# EAGLE design LEDMotherboardv2 (EAGLE 6.5.0)
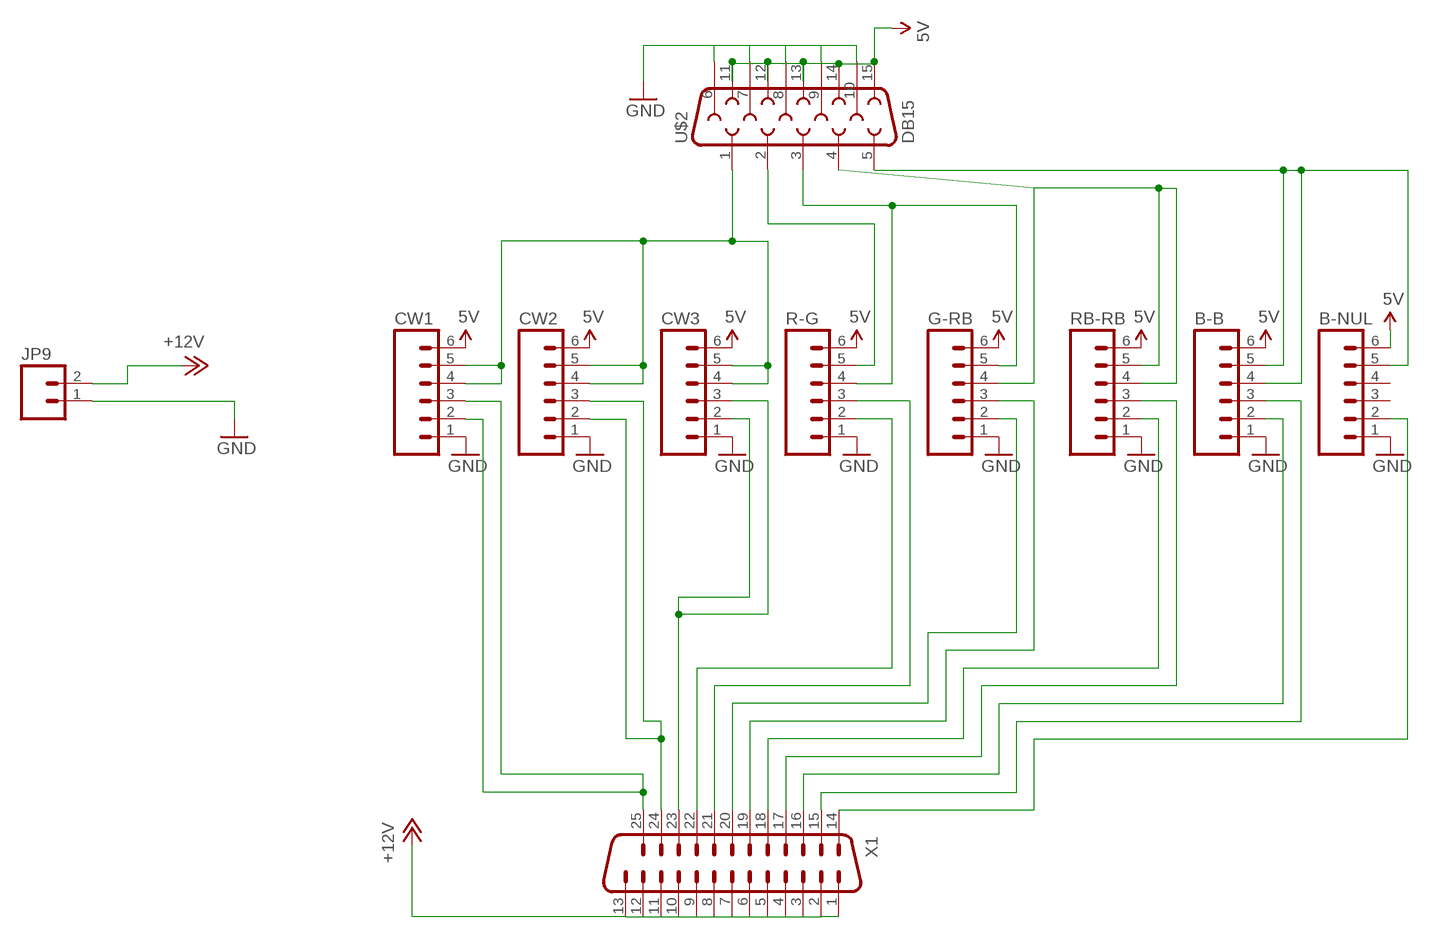
[diagram p0: schematic, sheet 1]

## Parts
B-B  M06LOCK_LONGPADS  [1X06_LOCK_LONGPADS]
B-NUL  M06LOCK_LONGPADS  [1X06_LOCK_LONGPADS]
CW1  M06LOCK_LONGPADS  [1X06_LOCK_LONGPADS]
CW2  M06LOCK_LONGPADS  [1X06_LOCK_LONGPADS]
CW3  M06LOCK_LONGPADS  [1X06_LOCK_LONGPADS]
G-RB  M06LOCK_LONGPADS  [1X06_LOCK_LONGPADS]
JP9  M02  [02P]
R-G  M06LOCK_LONGPADS  [1X06_LOCK_LONGPADS]
RB-RB  M06LOCK_LONGPADS  [1X06_LOCK_LONGPADS]
U$2  DB15  [DB15]
X1  DB25HP  [M25HP]

## Nets
5V: B-B.6 B-NUL.6 CW1.6 CW2.6 CW3.6 G-RB.6 R-G.6 RB-RB.6 U$2.11 U$2.12 U$2.13 U$2.14 U$2.15
+12V: JP9.2 X1.1 X1.2 X1.3 X1.4 X1.5 X1.6 X1.7 X1.8 X1.9 X1.10 X1.11 X1.12 X1.13
GND: B-B.1 B-NUL.1 CW1.1 CW2.1 CW3.1 G-RB.1 JP9.1 R-G.1 RB-RB.1 U$2.6 U$2.7 U$2.8 U$2.9 U$2.10
N$1: R-G.5 U$2.2
N$2: B-B.4 B-B.5 B-NUL.5 U$2.5
N$3: CW1.4 CW1.5 CW2.4 CW2.5 CW3.4 CW3.5 U$2.1
N$7: CW2.2 CW2.3 X1.24
N$13: G-RB.5 R-G.4 U$2.3
N$15: G-RB.4 RB-RB.4 RB-RB.5 U$2.4
N$21: CW3.2 CW3.3 X1.23
N$22: R-G.3 X1.21
N$23: R-G.2 X1.22
N$24: G-RB.2 X1.20
N$25: CW1.2 CW1.3 X1.25
N$27: G-RB.3 X1.19
N$28: RB-RB.2 X1.18
N$29: RB-RB.3 X1.17
N$30: B-B.2 X1.16
N$31: B-B.3 X1.15
N$32: B-NUL.2 X1.14
Unconnected: B-NUL.3 B-NUL.4

## Library data of the parts
B-B B-NUL CW1-CW3 G-RB R-G RB-RB = SparkFun-Connectors:M06: Header 6 Standard 6-pin 0.1" header. Use with straight break away headers (SKU : PRT-00116), right angle break away headers (PRT-00553), swiss pins (PRT-00743), machine pins (PRT-00117), and female headers (PRT-00115). Molex polarized connector foot print use with SKU : PRT-08094 with associated crimp pins and housings. NOTES ON THE VARIANTS LOCK and LOCK_LONGPADS... This footprint was designed to help hold the alignment of a through-hole component (i.e. 6-pin header) while soldering it into place. You may notice that each hole has been shifted either up or down by 0.005 of an inch from it's more standard position (which is a perfectly straight line). This slight alteration caused the pins (the squares in the middle) to touch the edges of the holes. Because they are alternating, it causes a "brace" to hold the component in place. 0.005 has proven to be the perfect amount of "off-center" position when using our standard breakaway headers. Although looks a little odd when you look at the bare footprint, once you have a header in there, the alteration is very hard to notice. Also,if you push a header all the way into place, it is covered up entirely on the bottom side. This idea of altering the position of holes to aid alignment will be further integrated into the Sparkfun Library for other footprints. It can help hold any component with 3 or more connection pins.
JP9 = con-amp-quick:M02: AMP QUICK CONNECTOR; OC_FARNELL: unknown; OC_NEWARK: unknown
U$2 = SparkFun-Connectors:DB15: DB15 / VGA right angle through-hole female connector.
X1 = SparkFun-Connectors:DB25: Various DB25 connectors

## Board
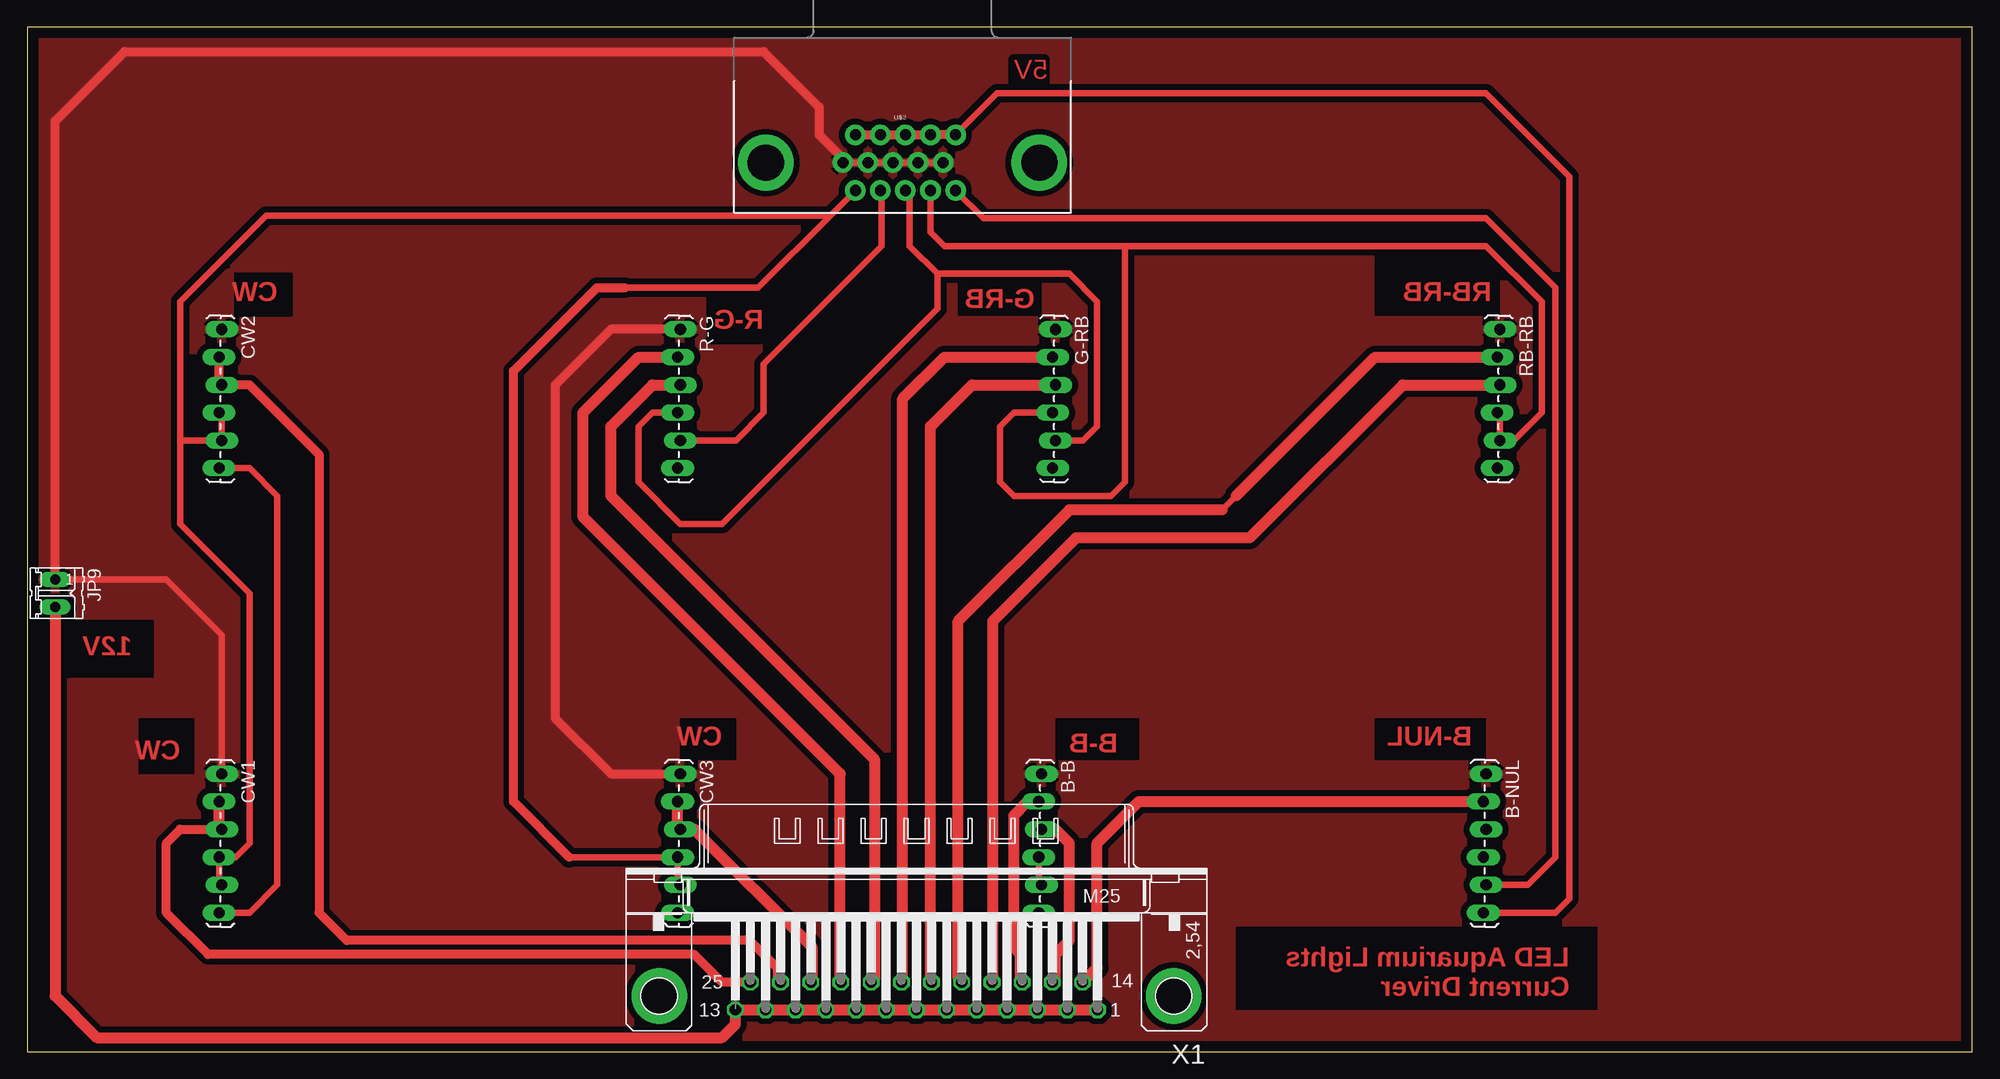
[diagram p1: board, top side]
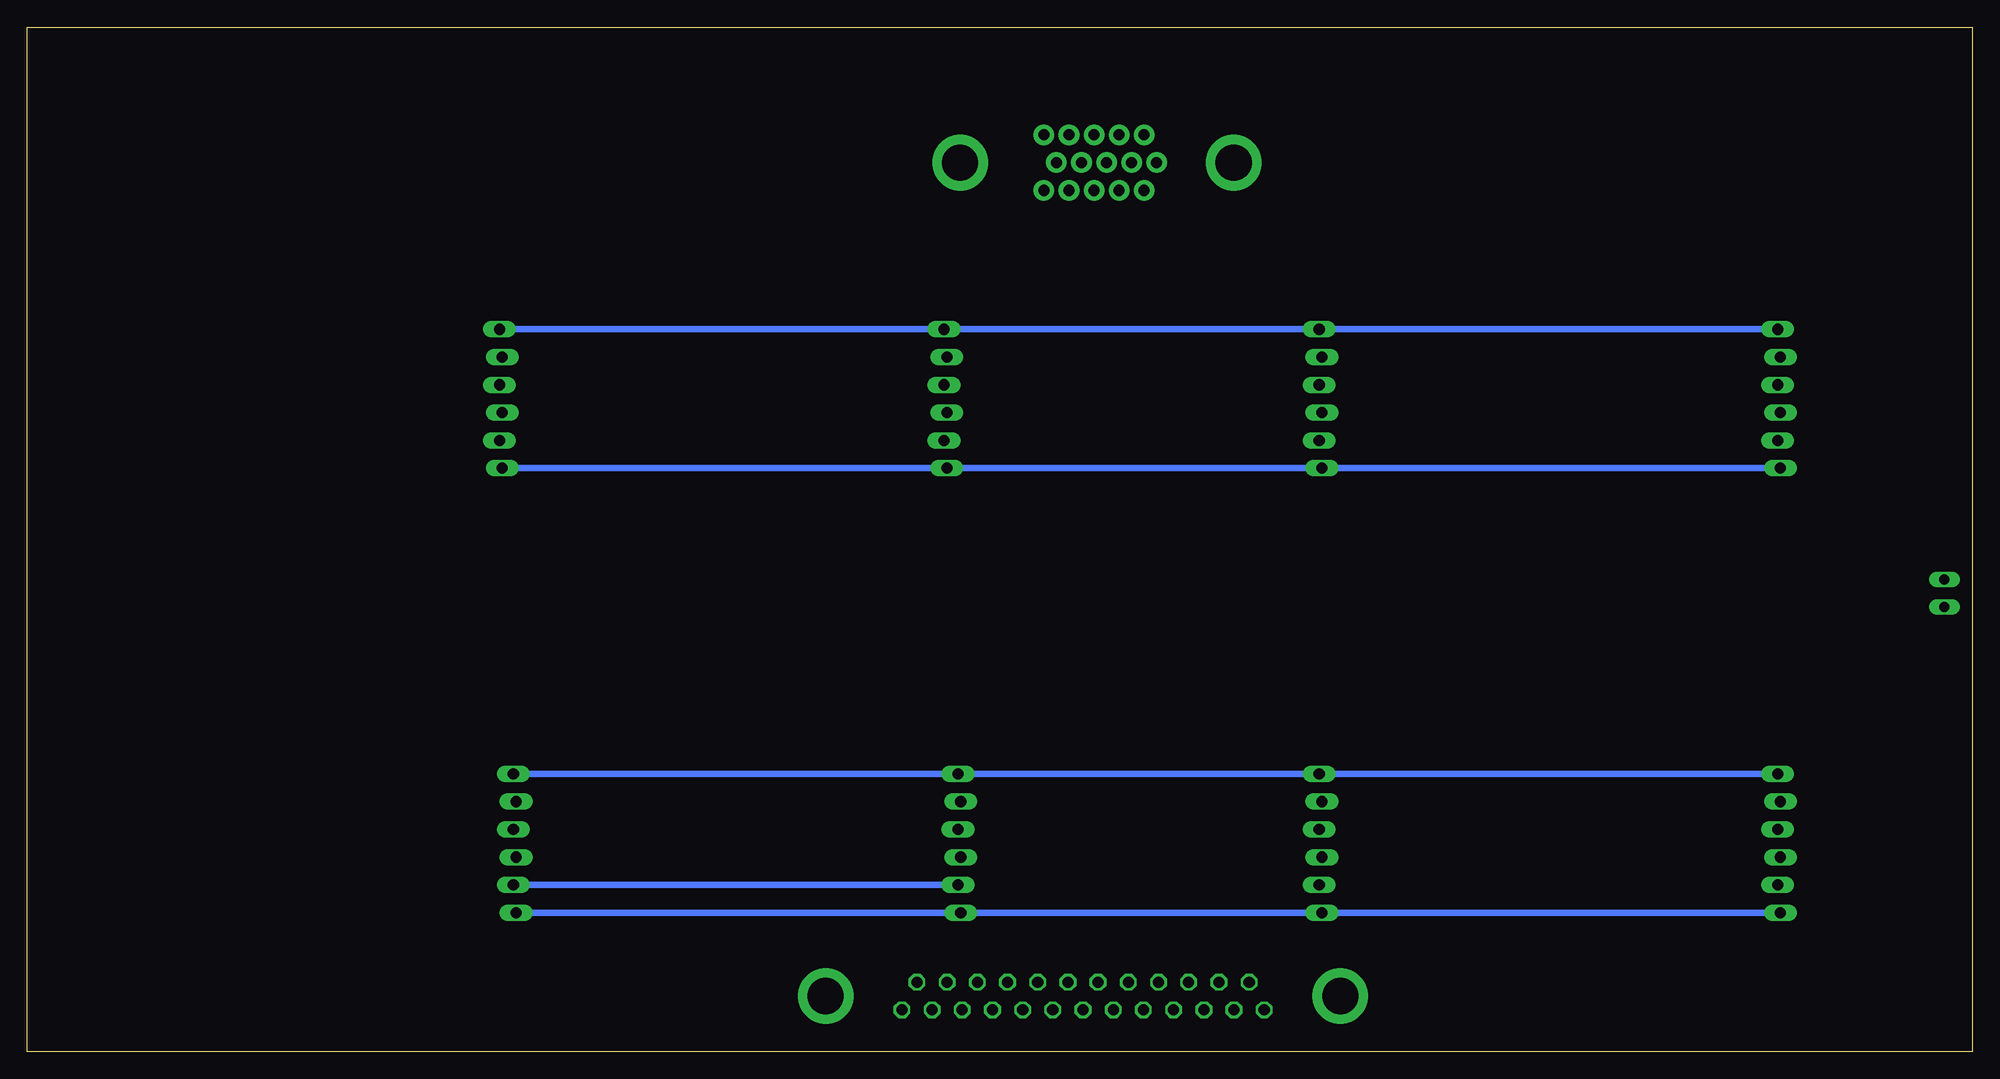
[diagram p2: board, bottom side, seen from below]

Size 177.78 x 93.65 mm. Coordinates in mm from the lower left corner, seen from the top.
Outline: 0,0 177.78,0 177.78,93.65 0,93.65 0,0
Copper layers (1*16): Top 0.035mm / dielectric 1.5mm / Bottom 0.035mm
Design rules "default": minimum track width 10mil, minimum drill 24mil, track to track 8mil, track to pad 8mil, pad to pad 8mil, via to via 8mil, smd to smd 8mil, copper to edge 40mil, drill to drill 8mil, minimum pad ring 10mil, minimum via ring 8mil, stop-mask expansion 4mil, vias tented up to drill 0mil, thermal gap 10mil

### Footprints (pad centres in the part's own frame; a part is rotated, then mirrored left to right if it is on the bottom)
1X06_LOCK_LONGPADS = drill 1.016 long: 1 0,0; 2 2.54,-0.254; 3 5.08,0; 4 7.62,-0.254; 5 10.16,0; 6 12.7,-0.254
02P = drill 0.914 long: 1 -1.27,0; 2 1.27,0
DB15 = drill 1.016 pad 1.88: 1 -4.32,-7.62; 2 -2.03,-7.62; 3 0.26,-7.62; 4 2.55,-7.62; 5 4.84,-7.62; 6 -5.46,-5.08; 7 -3.17,-5.08; 8 -0.88,-5.08; 9 1.41,-5.08; 10 3.7,-5.08; 11 -4.32,-2.54; 12 -2.03,-2.54; 13 0.26,-2.54; 14 2.55,-2.54; 15 4.84,-2.54 | drill 3.302 pad 5.08: G1 -12.5,-5.08; G2 12.5,-5.08
M25HP = drill 1.016 octagon: 1 -16.561,1.27; 2 -13.792,1.27; 3 -11.049,1.27; 4 -8.28,1.27; 5 -5.512,1.27; 6 -2.769,1.27; 7 0,1.27; 8 2.769,1.27; 9 5.512,1.27; 10 8.28,1.27; 11 11.049,1.27; 12 13.792,1.27; 13 16.561,1.27; 14 -15.189,-1.27; 15 -12.421,-1.27; 16 -9.652,-1.27; 17 -6.909,-1.27; 18 -4.14,-1.27; 19 -1.372,-1.27; 20 1.372,-1.27; 21 4.14,-1.27; 22 6.909,-1.27; 23 9.652,-1.27; 24 12.421,-1.27; 25 15.189,-1.27 | drill 3.302 pad 5.08: G1 -23.52,0; G2 23.52,0

### Placement (x,y rotation side)
B-B  92.71,25.4 270 top
B-NUL  133.35,25.4 270 top
CW1  17.78,25.4 270 top
CW2  17.78,66.04 270 top
CW3  59.69,25.4 270 top
G-RB  93.98,66.04 270 top
JP9  2.54,41.91 270 top
R-G  59.69,66.04 270 top
RB-RB  134.62,66.04 270 top
U$2  80.01,86.36 0 top
X1  81.28,5.08 180 top

### Tracks (layer width: path | path; a pad name or v marks a point on that pad's centre or on a via)
5V
  Top 0.61: U$2.15 88.66,87.63 133.35,87.63 140.97,80.01 140.97,13.97 139.7,12.7 B-NUL.6 | CW1.6 20.32,12.7 22.86,15.24 22.86,50.8 20.32,53.34 CW2.6
  Top 0.813: U$2.15 U$2.14 U$2.13 U$2.12 U$2.11
  Bottom 0.61: CW2.6 R-G.6 G-RB.6 RB-RB.6 | CW1.6 CW3.6 B-B.6 B-NUL.6
+12V
  Top 1.016: JP9.2 2.54,5.08 6.35,1.27 63.5,1.27 64.72,2.49 X1.13 X1.12 X1.11 X1.10 X1.9 X1.8 X1.7 X1.6 X1.5 X1.4 X1.3 X1.2 X1.1
GND
  Top 0.61: U$2.6 U$2.7 U$2.8 U$2.9 U$2.10 | JP9.1 12.7,43.18 17.78,38.1 CW1.1
  Top 0.813: JP9.1 2.54,85.09 8.89,91.44 67.31,91.44 72.39,86.36 72.39,83.82 74.55,81.66 U$2.6 | CW3.1 53.34,25.4 48.26,30.48 48.26,60.96 53.34,66.04 R-G.1
  Bottom 0.61: B-NUL.1 B-B.1 CW3.1 CW1.1 | RB-RB.1 G-RB.1 R-G.1 CW2.1
  pour Top (isolate 0.533): -1.27,95.25 179.07,95.25 179.07,-1.27 -1.27,-1.27
N$1
  Top 0.61: U$2.2 78.11,78.61 78.11,73.66 67.31,62.87 67.31,58.42 64.77,55.88 R-G.5
N$2
  Top 0.61: B-B.5 92.46,15.49 B-B.4 | U$2.5 87.39,76.2 133.35,76.2 139.7,69.85 139.7,17.78 137.16,15.24 B-NUL.5
  Bottom 0.61: B-B.5 B-NUL.5
N$3
  Top 0.61: CW2.4 17.78,58.17 CW2.5 13.97,55.88 | U$2.1 73.41,76.45 | 73.41,76.45 66.8,69.85 54.61,69.85 | 49.53,17.78 CW3.4 59.44,15.49 CW3.5 | CW1.5 17.53,15.49 CW1.4 19.05,17.78 20.32,19.05 20.32,41.91 13.97,48.26 13.97,55.88 | 13.97,55.88 13.97,68.58 21.84,76.45 73.41,76.45
  Top 0.813: 49.53,17.78 44.45,22.86 44.45,62.23 52.07,69.85 54.61,69.85
N$4
  cutout Top (rank 6): 3.81,39.37 11.43,39.37 11.43,34.29 3.81,34.29
N$5
  cutout Top: 19.05,68.58 19.05,71.12 24.13,71.12 24.13,67.31 19.05,67.31
N$6
  cutout Top: 62.23,68.58 68.58,68.58 68.58,64.77 62.23,64.77
N$7
  Top 0.813: X1.24 68.58,6.63 68.58,7.62 66.04,10.16 29.21,10.16 26.67,12.7 26.67,54.61 20.32,60.96 CW2.3 17.53,61.21 CW2.2
N$8
  cutout Top (isolate 0.254): 85.09,69.85 92.71,69.85 92.71,67.31 85.09,67.31
N$9
  cutout Top (isolate 0.254): 123.19,72.39 134.62,72.39 134.62,67.31 123.19,67.31 123.19,71.12
N$10
  cutout Top (isolate 0.254): 133.35,26.67 123.19,26.67 123.19,30.48 133.35,30.48
N$11
  cutout Top (isolate 0.254): 93.98,30.48 101.6,30.48 101.6,26.67 93.98,26.67 93.98,29.21
N$12
  cutout Top (isolate 0.254): 59.69,30.48 64.77,30.48 64.77,26.67 59.69,26.67
N$13
  Top 0.61: U$2.3 80.64,78.36 80.64,73.66 83.19,71.12 | 83.19,71.12 95.25,71.12 97.79,68.58 97.79,57.15 96.52,55.88 G-RB.5 | R-G.4 57.15,58.42 55.88,57.15 55.88,52.07 59.69,48.26 63.5,48.26 83.19,67.94 83.19,71.12
N$14
  cutout Top (isolate 0.254): 10.16,30.48 15.24,30.48 15.24,25.4 10.16,25.4
N$15
  Top 0.61: U$2.4 82.55,74.93 83.82,73.66 100.33,73.66 | 100.33,73.66 133.35,73.66 138.43,68.58 138.43,58.42 135.89,55.88 RB-RB.5 134.62,58.17 RB-RB.4 | G-RB.4 90.17,58.42 88.9,57.15 88.9,52.07 90.17,50.8 99.06,50.8 100.33,52.07 100.33,73.66
N$16
  cutout Top (isolate 0.254): 110.49,11.43 143.51,11.43 143.51,3.81 110.49,3.81
N$21
  Top 0.61: CW3.3 59.44,20.57
  Top 0.813: X1.23 71.75,6.48 | 60.96,20.32 CW3.3
  Top 1.016: 71.75,6.48 71.75,9.53 60.96,20.32 | 59.44,20.57 CW3.2
N$22
  Top 0.813: X1.21 77.47,6.68
  Top 1.016: 77.47,6.68 77.47,26.67 53.34,50.8 53.34,57.15 57.15,60.96 R-G.3
N$23
  Top 0.813: X1.22 74.3,6.43
  Top 1.016: 74.3,6.43 74.3,25.4 50.8,48.9 50.8,58.42 55.88,63.5 R-G.2
N$24
  Top 0.813: X1.20 80.01,6.45
  Top 1.016: 80.01,6.45 80.01,59.69 83.82,63.5 G-RB.2
N$25
  Top 0.61: CW1.3 17.53,20.57
  Top 0.813: X1.25 63.5,6.35 60.96,8.89 16.51,8.89 12.7,12.7 12.7,19.05 13.97,20.32 CW1.3
  Top 1.016: 17.53,20.57 CW1.2
N$27
  Top 0.813: X1.19 82.55,6.45
  Top 1.016: 82.55,6.45 82.55,57.15 86.36,60.96 G-RB.3
N$28
  Top 0.61: 110.49,50.8 109.22,49.53
  Top 0.813: X1.18 85.09,6.68
  Top 1.016: 85.09,6.68 85.09,39.37 95.25,49.53 109.22,49.53 | 110.49,50.8 123.19,63.5 RB-RB.2
N$29
  Top 0.813: X1.17 88.27,6.43
  Top 1.016: 88.27,6.43 88.27,39.37 95.89,46.99 111.76,46.99 125.73,60.96 RB-RB.3
N$30
  Top 0.813: X1.16 90.81,6.48 | 91.44,22.86 B-B.2
  Top 1.016: 90.81,6.48 90.81,8.89 90.17,9.53 90.17,21.59 91.44,22.86
N$31
  Top 0.813: X1.15 93.98,6.63 | 93.98,20.32 B-B.3
  Top 1.016: 93.98,6.63 93.98,8.89 95.25,10.16 95.25,19.05 93.98,20.32
N$32
  Top 1.016: X1.14 97.79,7.67 97.79,19.05 101.6,22.86 B-NUL.2

### Text on the board
Top: 5V | CW | RB-RB | G-RB | R-G | 12V | CW | B-NUL | CW | B-B | LED Aquarium Lights / Current Driver